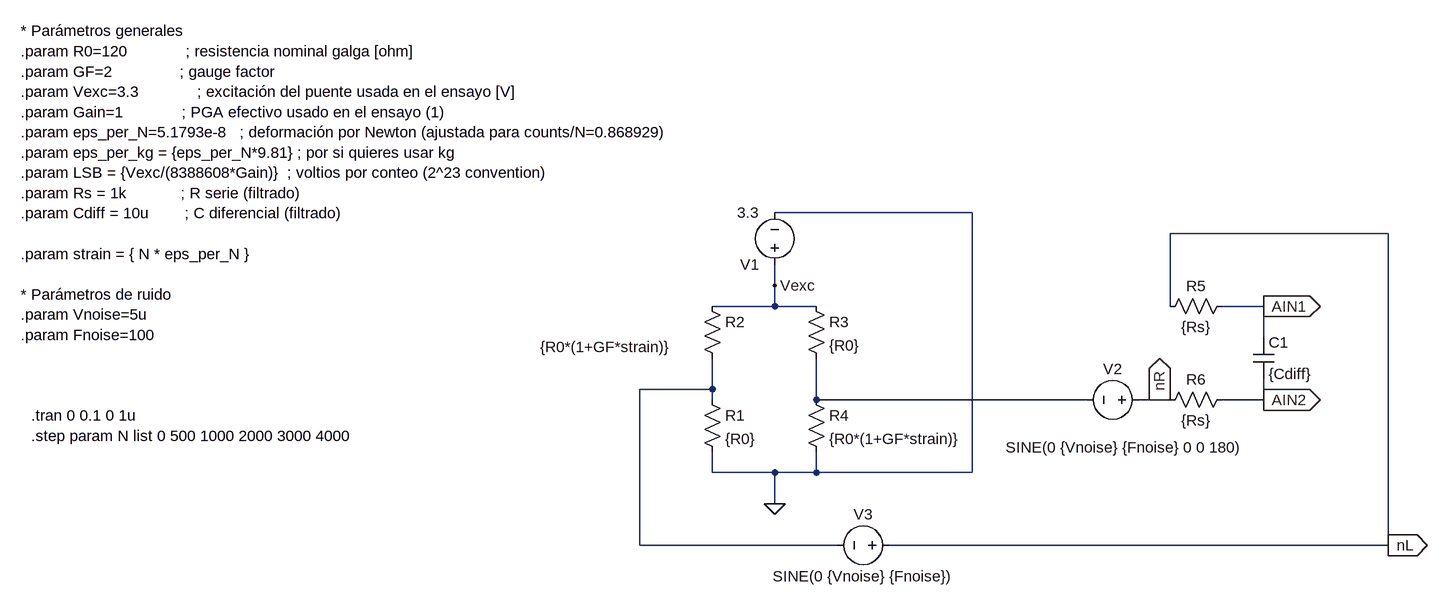
[diagram p0: schematic puente_calibrado.asc]
puente_calibrado.asc, the LTspice schematic file:
Version 4.1
SHEET 1 1272 680
WIRE 544 -80 240 -80
WIRE 1184 -48 848 -48
WIRE 240 32 240 0
WIRE 240 64 240 32
WIRE 240 64 144 64
WIRE 304 64 240 64
WIRE 848 64 848 -48
WIRE 992 64 928 64
WIRE 992 112 992 64
WIRE 144 192 144 144
WIRE 144 192 32 192
WIRE 144 208 144 192
WIRE 304 208 304 144
WIRE 720 208 304 208
WIRE 832 208 800 208
WIRE 848 208 832 208
WIRE 992 208 992 176
WIRE 992 208 928 208
WIRE 144 320 144 288
WIRE 240 320 144 320
WIRE 304 320 304 288
WIRE 304 320 240 320
WIRE 544 320 544 -80
WIRE 544 320 304 320
WIRE 240 368 240 320
WIRE 32 432 32 192
WIRE 336 432 32 432
WIRE 1184 432 1184 -48
WIRE 1184 432 416 432
FLAG 240 368 0
FLAG 240 32 Vexc
FLAG 1184 432 nL
IOPIN 1184 432 Out
FLAG 832 208 nR
IOPIN 832 208 Out
FLAG 992 64 AIN1
IOPIN 992 64 Out
FLAG 992 208 AIN2
IOPIN 992 208 Out
SYMBOL res 128 192 R0
SYMATTR InstName R1
SYMATTR Value {R0}
SYMBOL res 128 48 R0
WINDOW 3 -249 79 Left 2
SYMATTR Value {R0*(1+GF*strain)}
SYMATTR InstName R2
SYMBOL res 288 48 R0
SYMATTR InstName R3
SYMATTR Value {R0}
SYMBOL res 288 192 R0
SYMATTR InstName R4
SYMATTR Value {R0*(1+GF*strain)}
SYMBOL voltage 240 16 R180
WINDOW 123 0 0 Left 0
WINDOW 39 0 0 Left 0
SYMATTR InstName V1
SYMATTR Value 3.3
SYMBOL res 944 48 R90
WINDOW 0 0 56 VBottom 2
WINDOW 3 32 56 VTop 2
SYMATTR InstName R5
SYMATTR Value {Rs}
SYMBOL res 944 192 R90
WINDOW 0 0 56 VBottom 2
WINDOW 3 32 56 VTop 2
SYMATTR InstName R6
SYMATTR Value {Rs}
SYMBOL cap 976 112 R0
SYMATTR InstName C1
SYMATTR Value {Cdiff}
SYMBOL voltage 816 208 R90
WINDOW 0 -32 56 VBottom 2
WINDOW 3 58 38 VTop 2
SYMATTR InstName V2
SYMATTR Value SINE(0 {Vnoise} {Fnoise} 0 0 180)
SYMBOL voltage 432 432 R90
WINDOW 0 -32 56 VBottom 2
WINDOW 3 32 56 VTop 2
SYMATTR InstName V3
SYMATTR Value SINE(0 {Vnoise} {Fnoise})
TEXT -920 -360 Left 2 !* Parámetros generales\n.param R0=120             ; resistencia nominal galga [ohm]\n.param GF=2               ; gauge factor\n.param Vexc=3.3             ; excitación del puente usada en el ensayo [V]\n.param Gain=1             ; PGA efectivo usado en el ensayo (1)\n.param eps_per_N=5.1793e-8   ; deformación por Newton (ajustada para counts/N=0.868929)\n.param eps_per_kg = {eps_per_N*9.81} ; por si quieres usar kg\n.param LSB = {Vexc/(8388608*Gain)}  ; voltios por conteo (2^23 convention)\n.param Rs = 1k            ; R serie (filtrado)\n.param Cdiff = 10u        ; C diferencial (filtrado)\n \n.param strain = { N * eps_per_N }\n \n* Parámetros de ruido\n.param Vnoise=5u     \n.param Fnoise=100
TEXT -904 232 Left 2 !.tran 0 0.1 0 1u\n.step param N list 0 500 1000 2000 3000 4000

The netlist it stands for:
* puente_calibrado.asc
R1 N001 0 {R0}
R2 Vexc N001 {R0*(1+GF*strain)}
R3 Vexc N002 {R0}
R4 N002 0 {R0*(1+GF*strain)}
V1 Vexc 0 3.3
R5 AIN1 nL {Rs}
R6 AIN2 nR {Rs}
C1 AIN1 AIN2 {Cdiff}
V2 nR N002 SINE(0 {Vnoise} {Fnoise} 0 0 180)
V3 nL N001 SINE(0 {Vnoise} {Fnoise})
* Parámetros generales
.param R0=120             ; resistencia nominal galga [ohm]
.param GF=2               ; gauge factor
.param Vexc=3.3             ; excitación del puente usada en el ensayo [V]
.param Gain=1             ; PGA efectivo usado en el ensayo (1)
.param eps_per_N=5.1793e-8   ; deformación por Newton (ajustada para counts/N=0.868929)
.param eps_per_kg = {eps_per_N*9.81} ; por si quieres usar kg
.param LSB = {Vexc/(8388608*Gain)}  ; voltios por conteo (2^23 convention)
.param Rs = 1k            ; R serie (filtrado)
.param Cdiff = 10u        ; C diferencial (filtrado)
.param strain = { N * eps_per_N }
* Parámetros de ruido
.param Vnoise=5u
.param Fnoise=100
.tran 0 0.1 0 1u
.step param N list 0 500 1000 2000 3000 4000
.backanno
.end

* Results of the author's LTspice run, read from the files saved beside the schematic
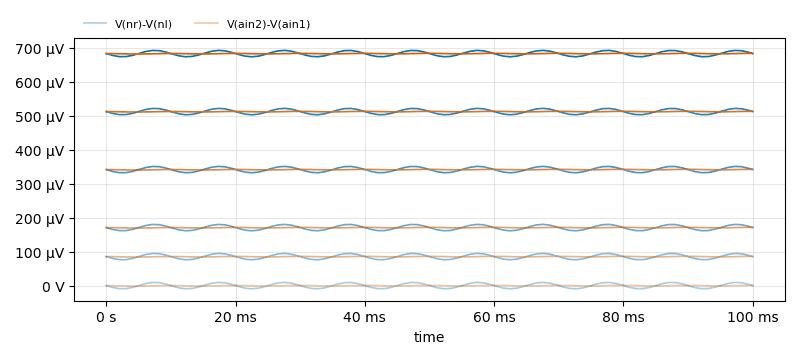
[diagram p1: Transient Analysis of puente_calibrado.asc, plotted from the saved traces]
* Transient Analysis, 6 runs:
*   V(nr)-V(nl) [n=0]: min -9.418 µV, max 9.418 µV, average -8.769 nV, rms 6.675 µV, last 0 V
*   V(nr)-V(nl) [n=500]: min 76.06 µV, max 94.89 µV, average 85.44 µV, rms 85.7 µV, last 85.47 µV
*   V(nr)-V(nl) [n=1000]: min 161.4 µV, max 180.4 µV, average 170.9 µV, rms 171 µV, last 170.9 µV
*   V(nr)-V(nl) [n=2000]: min 332.4 µV, max 351.2 µV, average 341.8 µV, rms 341.9 µV, last 341.9 µV
*   V(nr)-V(nl) [n=3000]: min 503.2 µV, max 522.1 µV, average 512.7 µV, rms 512.7 µV, last 512.7 µV
*   V(nr)-V(nl) [n=4000]: min 674 µV, max 693 µV, average 683.5 µV, rms 683.5 µV, last 683.5 µV
*   V(ain2)-V(ain1) [n=0]: min -1.311 µV, max 715.3 nV, average -155 nV, rms 581.1 nV, last 715.3 nV
*   V(ain2)-V(ain1) [n=500]: min 84.16 µV, max 86.19 µV, average 85.29 µV, rms 85.3 µV, last 86.19 µV
*   V(ain2)-V(ain1) [n=1000]: min 169.5 µV, max 171.7 µV, average 170.7 µV, rms 170.8 µV, last 171.7 µV
*   V(ain2)-V(ain1) [n=2000]: min 340.5 µV, max 342.6 µV, average 341.6 µV, rms 341.6 µV, last 342.6 µV
*   V(ain2)-V(ain1) [n=3000]: min 511.4 µV, max 513.4 µV, average 512.5 µV, rms 512.5 µV, last 513.4 µV
*   V(ain2)-V(ain1) [n=4000]: min 682.2 µV, max 684.3 µV, average 683.4 µV, rms 683.4 µV, last 684.3 µV